# Altium schematic sheet homecomputer-6502_5.SchDoc
size A4
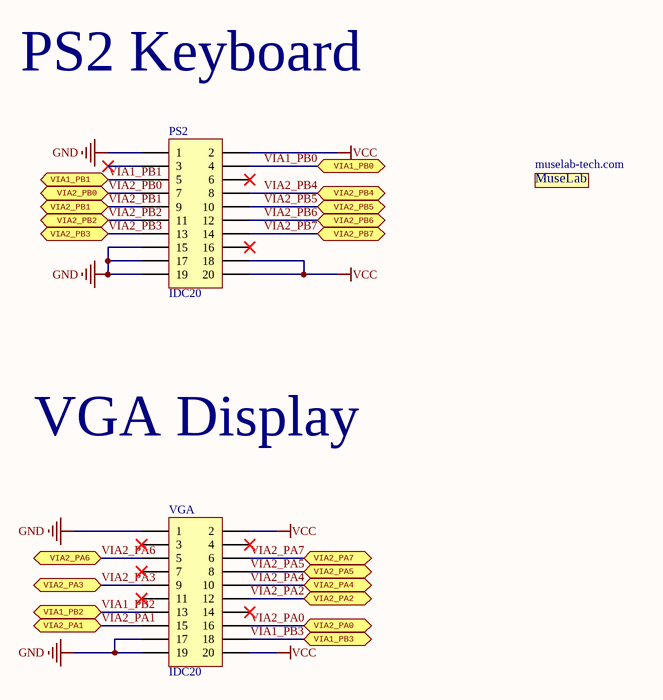
[diagram p0: homecomputer-6502_5.SchDoc]

## Parts
muselab-tech.com  LOGO_MuseLab  [LOGO_MUSELAB]  (value not drawn)
PS2  IDC20  [IDC20]
VGA  IDC20  [IDC20]

## Ports
VIA1_PB0, VIA1_PB1, VIA1_PB2, VIA1_PB3, VIA2_PA0, VIA2_PA1, VIA2_PA2, VIA2_PA3, VIA2_PA4, VIA2_PA5, VIA2_PA6, VIA2_PA7, VIA2_PB0, VIA2_PB1, VIA2_PB2, VIA2_PB3, VIA2_PB4, VIA2_PB5, VIA2_PB6, VIA2_PB7

## Nets
GND: PS2.1 PS2.15 PS2.17 PS2.19 VGA.1 VGA.17 VGA.19
VCC: PS2.2 PS2.18 PS2.20 VGA.2 VGA.20
VIA1_PB0: PS2.4 ; port VIA1_PB0
VIA1_PB1: PS2.5 ; port VIA1_PB1
VIA1_PB2: VGA.13 ; port VIA1_PB2
VIA1_PB3: VGA.18 ; port VIA1_PB3
VIA2_PA0: VGA.16 ; port VIA2_PA0
VIA2_PA1: VGA.15 ; port VIA2_PA1
VIA2_PA2: VGA.12 ; port VIA2_PA2
VIA2_PA3: VGA.9 ; port VIA2_PA3
VIA2_PA4: VGA.10 ; port VIA2_PA4
VIA2_PA5: VGA.8 ; port VIA2_PA5
VIA2_PA6: VGA.5 ; port VIA2_PA6
VIA2_PA7: VGA.6 ; port VIA2_PA7
VIA2_PB0: PS2.7 ; port VIA2_PB0
VIA2_PB1: PS2.9 ; port VIA2_PB1
VIA2_PB2: PS2.11 ; port VIA2_PB2
VIA2_PB3: PS2.13 ; port VIA2_PB3
VIA2_PB4: PS2.8 ; port VIA2_PB4
VIA2_PB5: PS2.10 ; port VIA2_PB5
VIA2_PB6: PS2.12 ; port VIA2_PB6
VIA2_PB7: PS2.14 ; port VIA2_PB7

Not connected (* = marked no-connect by the designer): PS2 3* 6* 16*; VGA 3* 4* 7* 11* 14*

## Notes on the sheet
- PS2 Keyboard
- VGA Display
- (in symbol LOGO_MuseLab) MuseLab